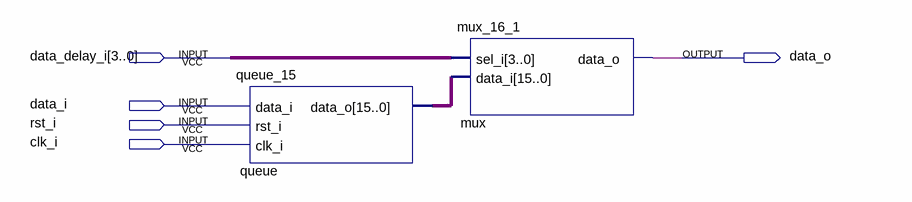
[diagram p0: schematic sheet]
// Quartus schematic delay_15.bdf as structural Verilog: 2 symbols, 5 pins
module delay_15 (
  input  [3:0] data_delay_i,
  input  data_i,
  input  rst_i,
  input  clk_i,
  output data_o
);

  wire [15:0] queue_data_o;

  queue_15 queue (.data_i(data_i), .rst_i(rst_i), .clk_i(clk_i), .data_o(queue_data_o));
  mux_16_1 mux (.sel_i(data_delay_i), .data_i(queue_data_o), .data_o(data_o));
endmodule
